# EAGLE schematic Data_memory (EAGLE 9.4.2)
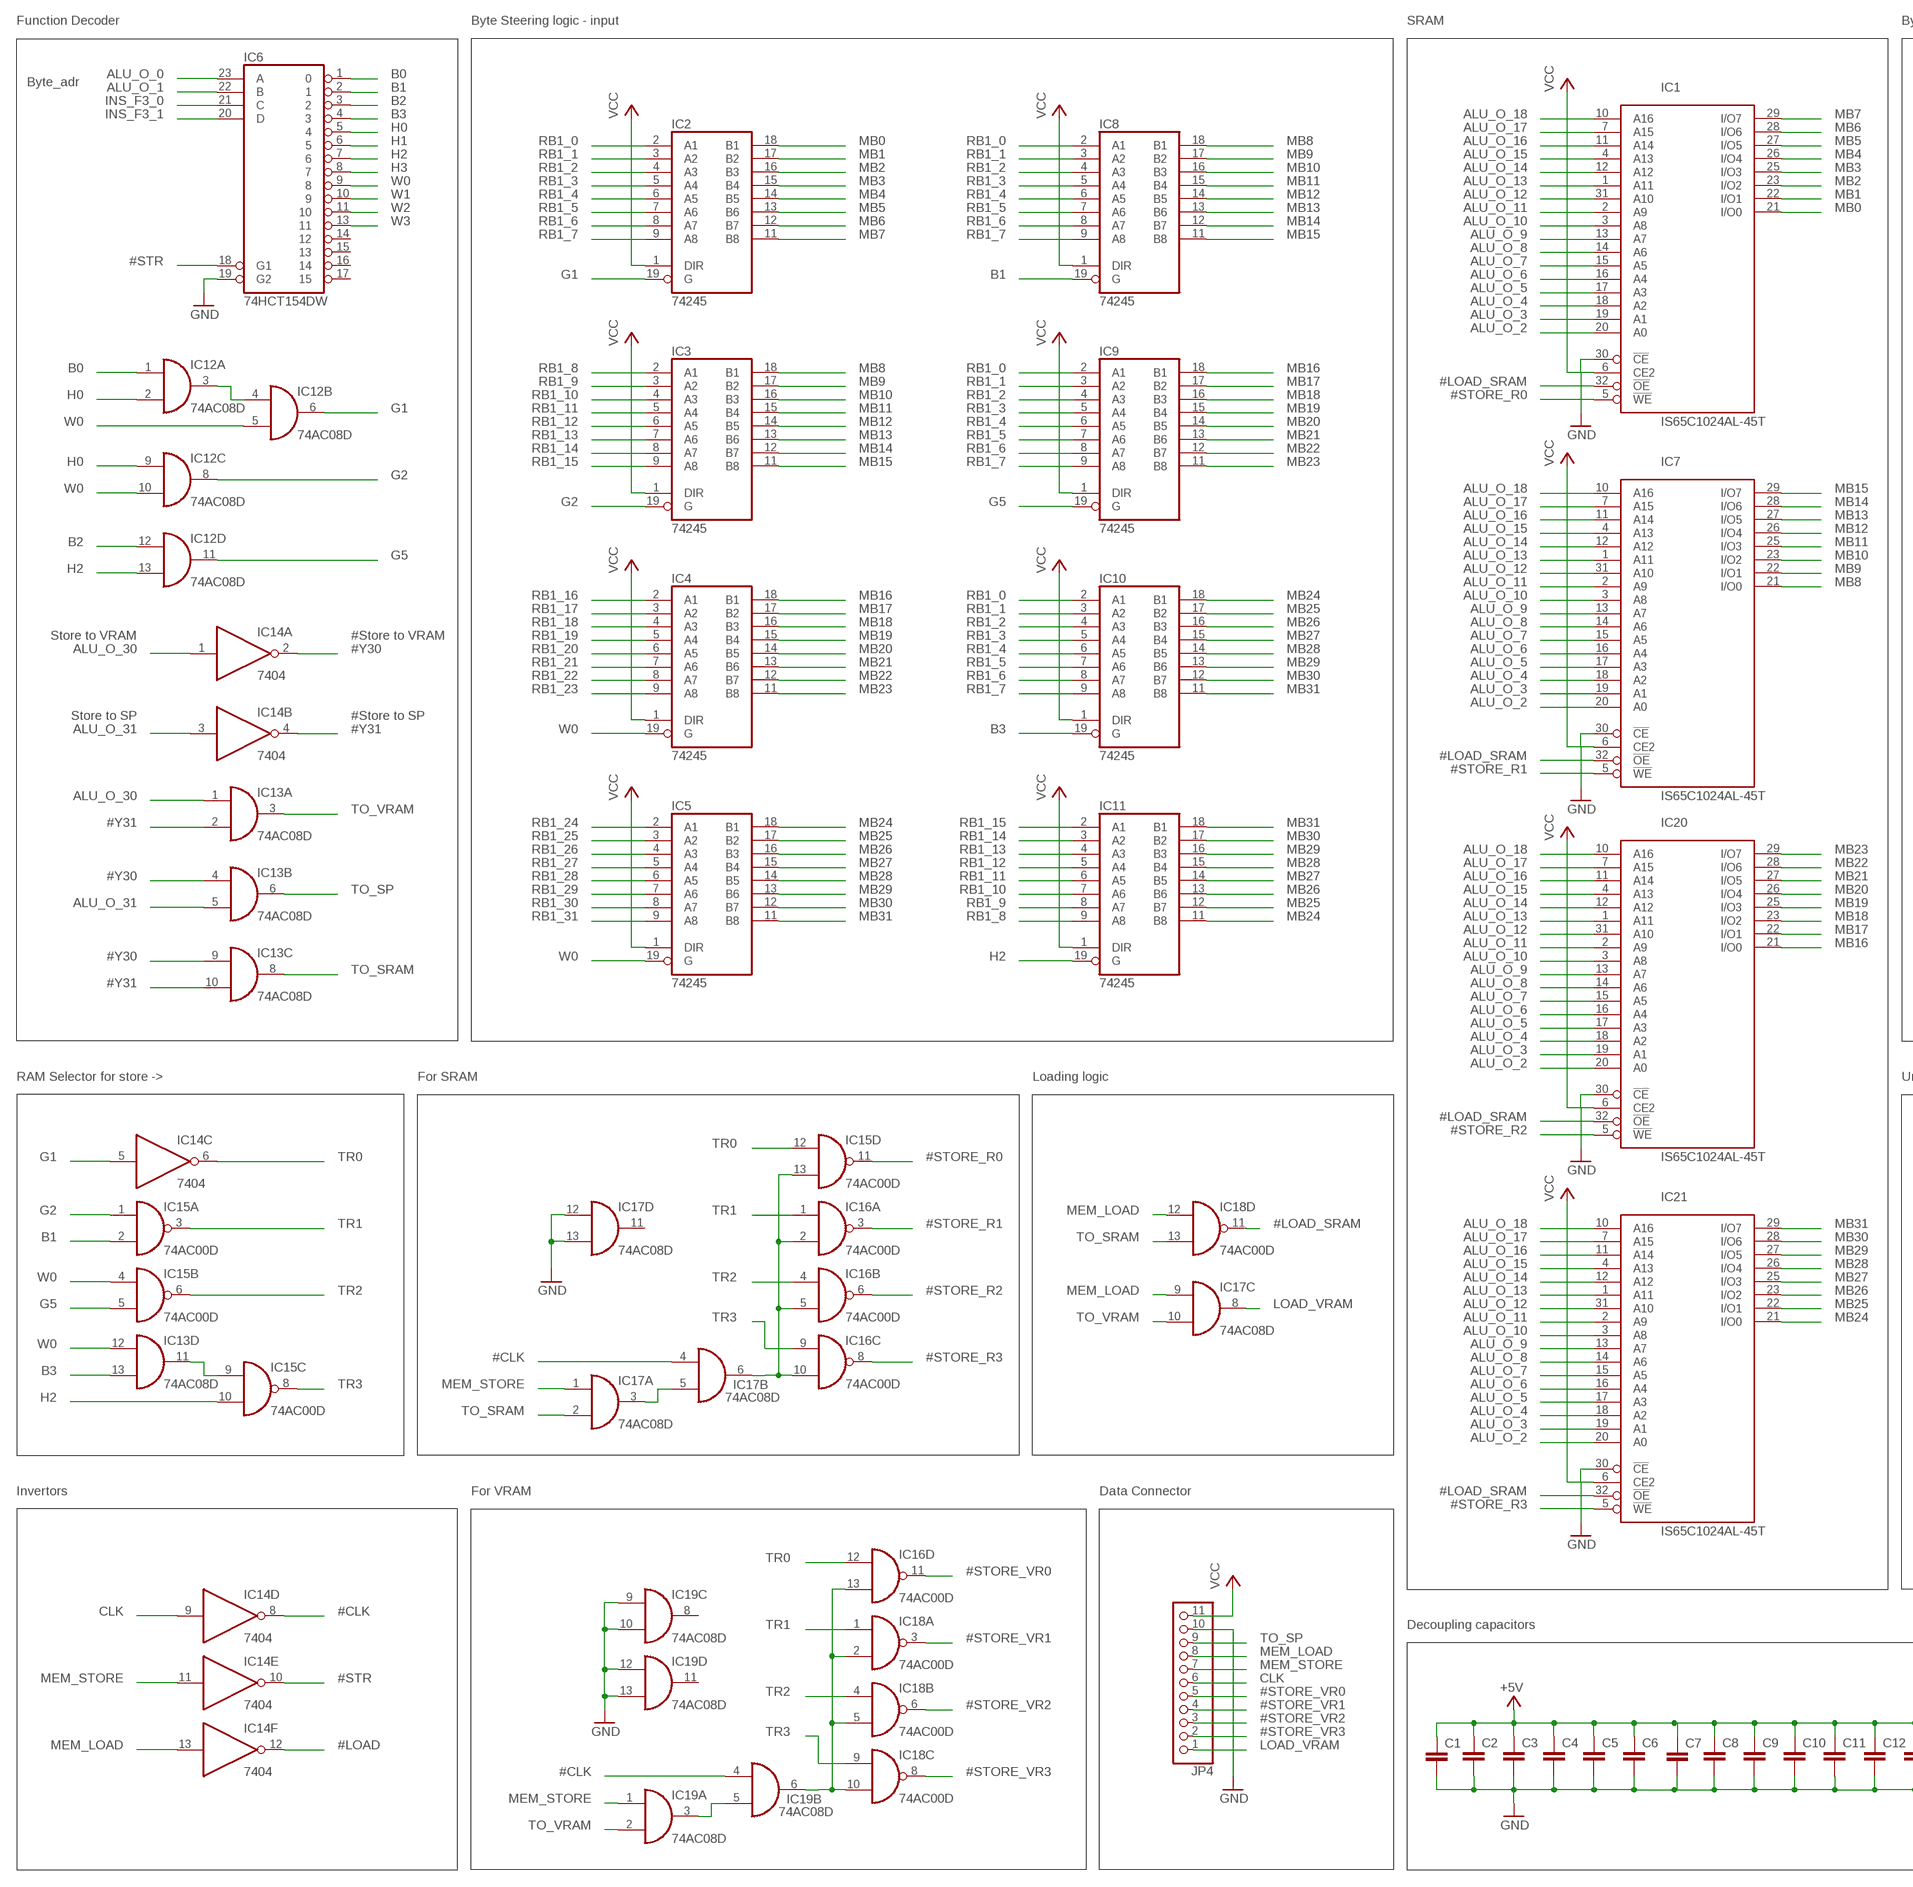
[diagram p0: schematic, sheet 1, part 1 of 2]
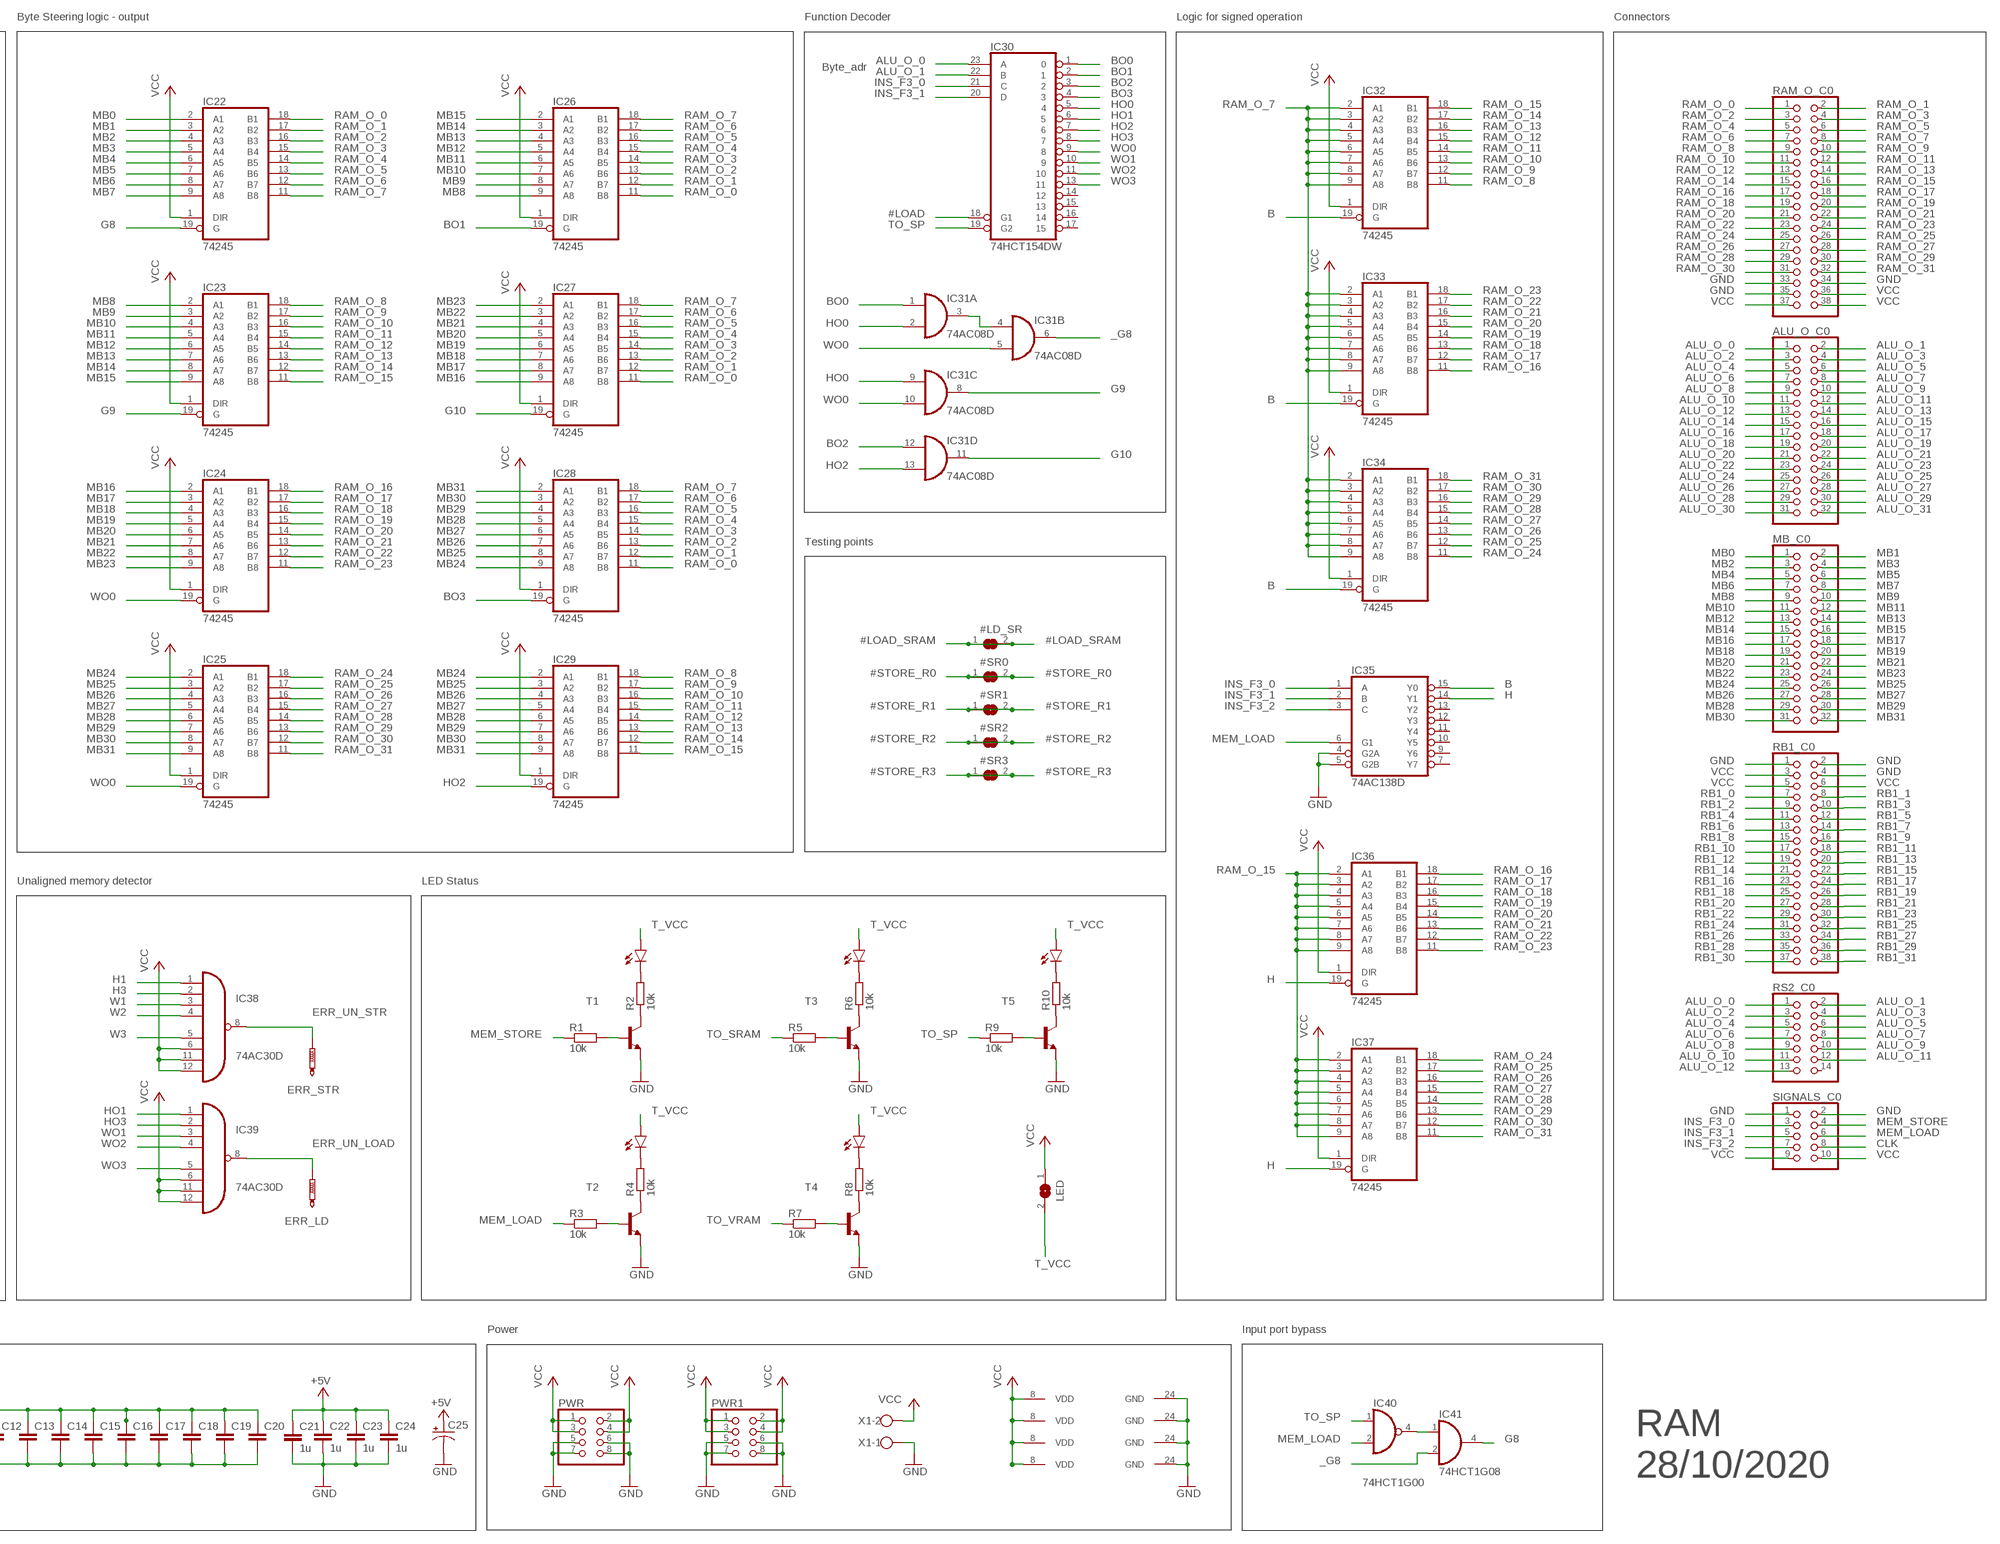
[diagram p1: schematic, sheet 1, part 2 of 2]

## Parts
#LD_SR  SJ  [SJ]
#SR0  SJ  [SJ]
#SR1  SJ  [SJ]
#SR2  SJ  [SJ]
#SR3  SJ  [SJ]
ALU_O_C0  PINHD-2X16  [2X16]
C1  C-EUC0805  [C0805]
C2  C-EUC0805  [C0805]
C3  C-EUC0805  [C0805]
C4  C-EUC0805  [C0805]
C5  C-EUC0805  [C0805]
C6  C-EUC0805  [C0805]
C7  C-EUC0805  [C0805]
C8  C-EUC0805  [C0805]
C9  C-EUC0805  [C0805]
C10  C-EUC0805  [C0805]
C11  C-EUC0805  [C0805]
C12  C-EUC0805  [C0805]
C13  C-EUC0805  [C0805]
C14  C-EUC0805  [C0805]
C15  C-EUC0805  [C0805]
C16  C-EUC0805  [C0805]
C17  C-EUC0805  [C0805]
C18  C-EUC0805  [C0805]
C19  C-EUC0805  [C0805]
C20  C-EUC0805  [C0805]
C21  1u  C-EUC0805  [C0805]
C22  1u  C-EUC0805  [C0805]
C23  1u  C-EUC0805  [C0805]
C24  1u  C-EUC0805  [C0805]
C25  CAPACITOR-P153CLV-1010  [153CLV-1010]
ERR_LD  PTR1B2,54  [B2,54]
ERR_STR  PTR1B2,54  [B2,54]
IC1  IS65C1024AL-45T  [TSOP-I-32-8X20MM]
IC2  74245  [TSSOP20]
IC3  74245  [TSSOP20]
IC4  74245  [TSSOP20]
IC5  74245  [TSSOP20]
IC6  74HCT154DW  [SO24W]
IC7  IS65C1024AL-45T  [TSOP-I-32-8X20MM]
IC8  74245  [TSSOP20]
IC9  74245  [TSSOP20]
IC10  74245  [TSSOP20]
IC11  74245  [TSSOP20]
IC12  74AC08D  [SO14]
IC13  74AC08D  [SO14]
IC14  7404  [TSSOP14]
IC15  74AC00D  [SO14]
IC16  74AC00D  [SO14]
IC17  74AC08D  [SO14]
IC18  74AC00D  [SO14]
IC19  74AC08D  [SO14]
IC20  IS65C1024AL-45T  [TSOP-I-32-8X20MM]
IC21  IS65C1024AL-45T  [TSOP-I-32-8X20MM]
IC22  74245  [TSSOP20]
IC23  74245  [TSSOP20]
IC24  74245  [TSSOP20]
IC25  74245  [TSSOP20]
IC26  74245  [TSSOP20]
IC27  74245  [TSSOP20]
IC28  74245  [TSSOP20]
IC29  74245  [TSSOP20]
IC30  74HCT154DW  [SO24W]
IC31  74AC08D  [SO14]
IC32  74245  [TSSOP20]
IC33  74245  [TSSOP20]
IC34  74245  [TSSOP20]
IC35  74AC138D  [SO16]
IC36  74245  [TSSOP20]
IC37  74245  [TSSOP20]
IC38  74AC30D  [SO14]
IC39  74AC30D  [SO14]
IC40  74HCT1G00  74AHC1G00DBV  [SOT23-5]
IC41  74HCT1G08  74AHC1G08DBV  [SOT23-5]
JP4  PINHD-1X11  [1X11]
LED  SJ  [SJ]
LED1  LEDSML0805  [SML0805]
LED2  LEDSML0805  [SML0805]
LED3  LEDSML0805  [SML0805]
LED4  LEDSML0805  [SML0805]
LED8  LEDSML0805  [SML0805]
MB_C0  PINHD-2X16  [2X16]
PWR  PINHD-2X4  [2X04]
PWR1  PINHD-2X4  [2X04]
R1  10k  R-EU_M0805  [M0805]
R2  10k  R-EU_M0805  [M0805]
R3  10k  R-EU_M0805  [M0805]
R4  10k  R-EU_M0805  [M0805]
R5  10k  R-EU_M0805  [M0805]
R6  10k  R-EU_M0805  [M0805]
R7  10k  R-EU_M0805  [M0805]
R8  10k  R-EU_M0805  [M0805]
R9  10k  R-EU_M0805  [M0805]
R10  10k  R-EU_M0805  [M0805]
RAM_O_C0  PINHD-2X19  [2X19]
RB1_C0  PINHD-2X19  [2X19]
RS2_C0  PINHD-2X7  [2X07]
SIGNALS_C0  PINHD-2X5  [2X05]
T1  MMBT4401LT1-NPN-SOT23-BEC  [SOT23-BEC]
T2  MMBT4401LT1-NPN-SOT23-BEC  [SOT23-BEC]
T3  MMBT4401LT1-NPN-SOT23-BEC  [SOT23-BEC]
T4  MMBT4401LT1-NPN-SOT23-BEC  [SOT23-BEC]
T5  MMBT4401LT1-NPN-SOT23-BEC  [SOT23-BEC]
X1  W237-102  [W237-102]

## Nets
#CLK: IC14.8(D:O) IC17.4(B:I0) IC19.4(B:I0)
#LOAD: IC14.12(F:O) IC30.18(G1)
#LOAD_SRAM: #LD_SR.1 #LD_SR.2 IC1.32(!OE) IC7.32(!OE) IC18.11(D:O) IC20.32(!OE) IC21.32(!OE)
#STORE_R0: #SR0.1 #SR0.2 IC1.5(!WE) IC15.11(D:O)
#STORE_R1: #SR1.1 #SR1.2 IC7.5(!WE) IC16.3(A:O)
#STORE_R2: #SR2.1 #SR2.2 IC16.6(B:O) IC20.5(!WE)
#STORE_R3: #SR3.1 #SR3.2 IC16.8(C:O) IC21.5(!WE)
#STORE_VR0: IC16.11(D:O) JP4.5
#STORE_VR1: IC18.3(A:O) JP4.4
#STORE_VR2: IC18.6(B:O) JP4.3
#STORE_VR3: IC18.8(C:O) JP4.2
#STR: IC6.18(G1) IC14.10(E:O)
#Y30: IC13.4(B:I0) IC13.9(C:I0) IC14.2(A:O)
#Y31: IC13.2(A:I1) IC13.10(C:I1) IC14.4(B:O)
_G8: IC31.6(B:O) IC41.2(I1)
ALU_O_0: ALU_O_C0.1 IC6.23(A) IC30.23(A) RS2_C0.1
ALU_O_1: ALU_O_C0.2 IC6.22(B) IC30.22(B) RS2_C0.2
ALU_O_2: ALU_O_C0.3 IC1.20(A0) IC7.20(A0) IC20.20(A0) IC21.20(A0) RS2_C0.3
ALU_O_3: ALU_O_C0.4 IC1.19(A1) IC7.19(A1) IC20.19(A1) IC21.19(A1) RS2_C0.4
ALU_O_4: ALU_O_C0.5 IC1.18(A2) IC7.18(A2) IC20.18(A2) IC21.18(A2) RS2_C0.5
ALU_O_5: ALU_O_C0.6 IC1.17(A3) IC7.17(A3) IC20.17(A3) IC21.17(A3) RS2_C0.6
ALU_O_6: ALU_O_C0.7 IC1.16(A4) IC7.16(A4) IC20.16(A4) IC21.16(A4) RS2_C0.7
ALU_O_7: ALU_O_C0.8 IC1.15(A5) IC7.15(A5) IC20.15(A5) IC21.15(A5) RS2_C0.8
ALU_O_8: ALU_O_C0.9 IC1.14(A6) IC7.14(A6) IC20.14(A6) IC21.14(A6) RS2_C0.9
ALU_O_9: ALU_O_C0.10 IC1.13(A7) IC7.13(A7) IC20.13(A7) IC21.13(A7) RS2_C0.10
ALU_O_10: ALU_O_C0.11 IC1.3(A8) IC7.3(A8) IC20.3(A8) IC21.3(A8) RS2_C0.11
ALU_O_11: ALU_O_C0.12 IC1.2(A9) IC7.2(A9) IC20.2(A9) IC21.2(A9) RS2_C0.12
ALU_O_12: ALU_O_C0.13 IC1.31(A10) IC7.31(A10) IC20.31(A10) IC21.31(A10) RS2_C0.13
ALU_O_13: ALU_O_C0.14 IC1.1(A11) IC7.1(A11) IC20.1(A11) IC21.1(A11)
ALU_O_14: ALU_O_C0.15 IC1.12(A12) IC7.12(A12) IC20.12(A12) IC21.12(A12)
ALU_O_15: ALU_O_C0.16 IC1.4(A13) IC7.4(A13) IC20.4(A13) IC21.4(A13)
ALU_O_16: ALU_O_C0.17 IC1.11(A14) IC7.11(A14) IC20.11(A14) IC21.11(A14)
ALU_O_17: ALU_O_C0.18 IC1.7(A15) IC7.7(A15) IC20.7(A15) IC21.7(A15)
ALU_O_18: ALU_O_C0.19 IC1.10(A16) IC7.10(A16) IC20.10(A16) IC21.10(A16)
ALU_O_19: ALU_O_C0.20
ALU_O_20: ALU_O_C0.21
ALU_O_21: ALU_O_C0.22
ALU_O_22: ALU_O_C0.23
ALU_O_23: ALU_O_C0.24
ALU_O_24: ALU_O_C0.25
ALU_O_25: ALU_O_C0.26
ALU_O_26: ALU_O_C0.27
ALU_O_27: ALU_O_C0.28
ALU_O_28: ALU_O_C0.29
ALU_O_29: ALU_O_C0.30
ALU_O_30: ALU_O_C0.31 IC13.1(A:I0) IC14.1(A:I)
ALU_O_31: ALU_O_C0.32 IC13.5(B:I1) IC14.3(B:I)
B: IC32.19(G) IC33.19(G) IC34.19(G) IC35.15(Y0)
B0: IC6.1 IC12.1(A:I0)
B1: IC6.2 IC8.19(G) IC15.2(A:I1)
B2: IC6.3 IC12.12(D:I0)
B3: IC6.4 IC10.19(G) IC13.13(D:I1)
BO0: IC30.1 IC31.1(A:I0)
BO1: IC26.19(G) IC30.2
BO2: IC30.3 IC31.12(D:I0)
BO3: IC28.19(G) IC30.4
CLK: IC14.9(D:I) JP4.6 SIGNALS_C0.8
ERR_UN_LOAD: ERR_LD.TP IC39.8(O)
ERR_UN_STR: ERR_STR.TP IC38.8(O)
G1: IC2.19(G) IC12.6(B:O) IC14.5(C:I)
G2: IC3.19(G) IC12.8(C:O) IC15.1(A:I0)
G5: IC9.19(G) IC12.11(D:O) IC15.5(B:I1)
G8: IC22.19(G) IC41.4(O)
G9: IC23.19(G) IC31.8(C:O)
G10: IC27.19(G) IC31.11(D:O)
GND: C1.2 C2.2 C3.2 C4.2 C5.2 C6.2 C7.2 C8.2 C9.2 C10.2 C11.2 C12.2 C13.2 C14.2 C15.2 C16.2 C17.2 C18.2 C19.2 C20.2 C21.2 C22.2 C23.2 C24.2 C25.- IC1.24(GND) IC1.30(!CE) IC6.19(G2) IC7.24(GND) IC7.30(!CE) IC17.12(D:I0) IC17.13(D:I1) IC19.9(C:I0) IC19.10(C:I1) IC19.12(D:I0) IC19.13(D:I1) IC20.24(GND) IC20.30(!CE) IC21.24(GND) IC21.30(!CE) IC35.4(G2A) IC35.5(G2B) JP4.10 PWR1.5 PWR1.6 PWR1.7 PWR1.8 PWR.5 PWR.6 PWR.7 PWR.8 RAM_O_C0.33 RAM_O_C0.34 RAM_O_C0.35 RB1_C0.1 RB1_C0.2 RB1_C0.4 SIGNALS_C0.1 SIGNALS_C0.2 T1.E T2.E T3.E T4.E T5.E X1.1
H: IC35.14(Y1) IC36.19(G) IC37.19(G)
H0: IC6.5 IC12.2(A:I1) IC12.9(C:I0)
H1: IC6.6 IC38.1(I0)
H2: IC6.7 IC11.19(G) IC12.13(D:I1) IC15.10(C:I1)
H3: IC6.8 IC38.2(I1)
HO0: IC30.5 IC31.2(A:I1) IC31.9(C:I0)
HO1: IC30.6 IC39.1(I0)
HO2: IC29.19(G) IC30.7 IC31.13(D:I1)
HO3: IC30.8 IC39.2(I1)
INS_F3_0: IC6.21(C) IC30.21(C) IC35.1(A) SIGNALS_C0.3
INS_F3_1: IC6.20(D) IC30.20(D) IC35.2(B) SIGNALS_C0.5
INS_F3_2: IC35.3(C) SIGNALS_C0.7
LOAD_VRAM: IC17.8(C:O) JP4.1
MB0: IC1.21(I/O0) IC2.18(B1) IC22.2(A1) MB_C0.1
MB1: IC1.22(I/O1) IC2.17(B2) IC22.3(A2) MB_C0.2
MB2: IC1.23(I/O2) IC2.16(B3) IC22.4(A3) MB_C0.3
MB3: IC1.25(I/O3) IC2.15(B4) IC22.5(A4) MB_C0.4
MB4: IC1.26(I/O4) IC2.14(B5) IC22.6(A5) MB_C0.5
MB5: IC1.27(I/O5) IC2.13(B6) IC22.7(A6) MB_C0.6
MB6: IC1.28(I/O6) IC2.12(B7) IC22.8(A7) MB_C0.7
MB7: IC1.29(I/O7) IC2.11(B8) IC22.9(A8) MB_C0.8
MB8: IC3.18(B1) IC7.21(I/O0) IC8.18(B1) IC23.2(A1) IC26.9(A8) MB_C0.9
MB9: IC3.17(B2) IC7.22(I/O1) IC8.17(B2) IC23.3(A2) IC26.8(A7) MB_C0.10
MB10: IC3.16(B3) IC7.23(I/O2) IC8.16(B3) IC23.4(A3) IC26.7(A6) MB_C0.11
MB11: IC3.15(B4) IC7.25(I/O3) IC8.15(B4) IC23.5(A4) IC26.6(A5) MB_C0.12
MB12: IC3.14(B5) IC7.26(I/O4) IC8.14(B5) IC23.6(A5) IC26.5(A4) MB_C0.13
MB13: IC3.13(B6) IC7.27(I/O5) IC8.13(B6) IC23.7(A6) IC26.4(A3) MB_C0.14
MB14: IC3.12(B7) IC7.28(I/O6) IC8.12(B7) IC23.8(A7) IC26.3(A2) MB_C0.15
MB15: IC3.11(B8) IC7.29(I/O7) IC8.11(B8) IC23.9(A8) IC26.2(A1) MB_C0.16
MB16: IC4.18(B1) IC9.18(B1) IC20.21(I/O0) IC24.2(A1) IC27.9(A8) MB_C0.17
MB17: IC4.17(B2) IC9.17(B2) IC20.22(I/O1) IC24.3(A2) IC27.8(A7) MB_C0.18
MB18: IC4.16(B3) IC9.16(B3) IC20.23(I/O2) IC24.4(A3) IC27.7(A6) MB_C0.19
MB19: IC4.15(B4) IC9.15(B4) IC20.25(I/O3) IC24.5(A4) IC27.6(A5) MB_C0.20
MB20: IC4.14(B5) IC9.14(B5) IC20.26(I/O4) IC24.6(A5) IC27.5(A4) MB_C0.21
MB21: IC4.13(B6) IC9.13(B6) IC20.27(I/O5) IC24.7(A6) IC27.4(A3) MB_C0.22
MB22: IC4.12(B7) IC9.12(B7) IC20.28(I/O6) IC24.8(A7) IC27.3(A2) MB_C0.23
MB23: IC4.11(B8) IC9.11(B8) IC20.29(I/O7) IC24.9(A8) IC27.2(A1) MB_C0.24
MB24: IC5.18(B1) IC10.18(B1) IC11.11(B8) IC21.21(I/O0) IC25.2(A1) IC28.9(A8) IC29.2(A1) MB_C0.25
MB25: IC5.17(B2) IC10.17(B2) IC11.12(B7) IC21.22(I/O1) IC25.3(A2) IC28.8(A7) IC29.3(A2) MB_C0.26
MB26: IC5.16(B3) IC10.16(B3) IC11.13(B6) IC21.23(I/O2) IC25.4(A3) IC28.7(A6) IC29.4(A3) MB_C0.27
MB27: IC5.15(B4) IC10.15(B4) IC11.14(B5) IC21.25(I/O3) IC25.5(A4) IC28.6(A5) IC29.5(A4) MB_C0.28
MB28: IC5.14(B5) IC10.14(B5) IC11.15(B4) IC21.26(I/O4) IC25.6(A5) IC28.5(A4) IC29.6(A5) MB_C0.29
MB29: IC5.13(B6) IC10.13(B6) IC11.16(B3) IC21.27(I/O5) IC25.7(A6) IC28.4(A3) IC29.7(A6) MB_C0.30
MB30: IC5.12(B7) IC10.12(B7) IC11.17(B2) IC21.28(I/O6) IC25.8(A7) IC28.3(A2) IC29.8(A7) MB_C0.31
MB31: IC5.11(B8) IC10.11(B8) IC11.18(B1) IC21.29(I/O7) IC25.9(A8) IC28.2(A1) IC29.9(A8) MB_C0.32
MEM_LOAD: IC14.13(F:I) IC17.9(C:I0) IC18.12(D:I0) IC35.6(G1) IC40.2(I1) JP4.8 R3.1 SIGNALS_C0.6
MEM_STORE: IC14.11(E:I) IC17.1(A:I0) IC19.1(A:I0) JP4.7 R1.1 SIGNALS_C0.4
N$1: IC12.3(A:O) IC12.4(B:I0)
N$2: IC13.11(D:O) IC15.9(C:I0)
N$3: IC17.3(A:O) IC17.5(B:I1)
N$4: IC16.13(D:I1) IC18.2(A:I1) IC18.5(B:I1) IC18.10(C:I1) IC19.6(B:O)
N$5: IC19.3(A:O) IC19.5(B:I1)
N$6: IC31.3(A:O) IC31.4(B:I0)
N$7: IC15.13(D:I1) IC16.2(A:I1) IC16.5(B:I1) IC16.10(C:I1) IC17.6(B:O)
N$8: R1.2 T1.B
N$9: R3.2 T2.B
N$10: LED1.C R2.2
N$11: R2.1 T1.C
N$12: LED8.C R4.2
N$13: R4.1 T2.C
N$14: R5.2 T3.B
N$15: LED2.C R6.2
N$16: R6.1 T3.C
N$17: R7.2 T4.B
N$18: LED3.C R8.2
N$19: R8.1 T4.C
N$20: R9.2 T5.B
N$21: LED4.C R10.2
N$22: R10.1 T5.C
N$23: IC40.4(O) IC41.1(I0)
RAM_O_0: IC22.18(B1) IC26.11(B8) IC27.11(B8) IC28.11(B8) RAM_O_C0.1
RAM_O_1: IC22.17(B2) IC26.12(B7) IC27.12(B7) IC28.12(B7) RAM_O_C0.2
RAM_O_2: IC22.16(B3) IC26.13(B6) IC27.13(B6) IC28.13(B6) RAM_O_C0.3
RAM_O_3: IC22.15(B4) IC26.14(B5) IC27.14(B5) IC28.14(B5) RAM_O_C0.4
RAM_O_4: IC22.14(B5) IC26.15(B4) IC27.15(B4) IC28.15(B4) RAM_O_C0.5
RAM_O_5: IC22.13(B6) IC26.16(B3) IC27.16(B3) IC28.16(B3) RAM_O_C0.6
RAM_O_6: IC22.12(B7) IC26.17(B2) IC27.17(B2) IC28.17(B2) RAM_O_C0.7
RAM_O_7: IC22.11(B8) IC26.18(B1) IC27.18(B1) IC28.18(B1) IC32.2(A1) IC32.3(A2) IC32.4(A3) IC32.5(A4) IC32.6(A5) IC32.7(A6) IC32.8(A7) IC32.9(A8) IC33.2(A1) IC33.3(A2) IC33.4(A3) IC33.5(A4) IC33.6(A5) IC33.7(A6) IC33.8(A7) IC33.9(A8) IC34.2(A1) IC34.3(A2) IC34.4(A3) IC34.5(A4) IC34.6(A5) IC34.7(A6) IC34.8(A7) IC34.9(A8) RAM_O_C0.8
RAM_O_8: IC23.18(B1) IC29.18(B1) IC32.11(B8) RAM_O_C0.9
RAM_O_9: IC23.17(B2) IC29.17(B2) IC32.12(B7) RAM_O_C0.10
RAM_O_10: IC23.16(B3) IC29.16(B3) IC32.13(B6) RAM_O_C0.11
RAM_O_11: IC23.15(B4) IC29.15(B4) IC32.14(B5) RAM_O_C0.12
RAM_O_12: IC23.14(B5) IC29.14(B5) IC32.15(B4) RAM_O_C0.13
RAM_O_13: IC23.13(B6) IC29.13(B6) IC32.16(B3) RAM_O_C0.14
RAM_O_14: IC23.12(B7) IC29.12(B7) IC32.17(B2) RAM_O_C0.15
RAM_O_15: IC23.11(B8) IC29.11(B8) IC32.18(B1) IC36.2(A1) IC36.3(A2) IC36.4(A3) IC36.5(A4) IC36.6(A5) IC36.7(A6) IC36.8(A7) IC36.9(A8) IC37.2(A1) IC37.3(A2) IC37.4(A3) IC37.5(A4) IC37.6(A5) IC37.7(A6) IC37.8(A7) IC37.9(A8) RAM_O_C0.16
RAM_O_16: IC24.18(B1) IC33.11(B8) IC36.18(B1) RAM_O_C0.17
RAM_O_17: IC24.17(B2) IC33.12(B7) IC36.17(B2) RAM_O_C0.18
RAM_O_18: IC24.16(B3) IC33.13(B6) IC36.16(B3) RAM_O_C0.19
RAM_O_19: IC24.15(B4) IC33.14(B5) IC36.15(B4) RAM_O_C0.20
RAM_O_20: IC24.14(B5) IC33.15(B4) IC36.14(B5) RAM_O_C0.21
RAM_O_21: IC24.13(B6) IC33.16(B3) IC36.13(B6) RAM_O_C0.22
RAM_O_22: IC24.12(B7) IC33.17(B2) IC36.12(B7) RAM_O_C0.23
RAM_O_23: IC24.11(B8) IC33.18(B1) IC36.11(B8) RAM_O_C0.24
RAM_O_24: IC25.18(B1) IC34.11(B8) IC37.18(B1) RAM_O_C0.25
RAM_O_25: IC25.17(B2) IC34.12(B7) IC37.17(B2) RAM_O_C0.26
RAM_O_26: IC25.16(B3) IC34.13(B6) IC37.16(B3) RAM_O_C0.27
RAM_O_27: IC25.15(B4) IC34.14(B5) IC37.15(B4) RAM_O_C0.28
RAM_O_28: IC25.14(B5) IC34.15(B4) IC37.14(B5) RAM_O_C0.29
RAM_O_29: IC25.13(B6) IC34.16(B3) IC37.13(B6) RAM_O_C0.30
RAM_O_30: IC25.12(B7) IC34.17(B2) IC37.12(B7) RAM_O_C0.31
RAM_O_31: IC25.11(B8) IC34.18(B1) IC37.11(B8) RAM_O_C0.32
RB1_0: IC2.2(A1) IC8.2(A1) IC9.2(A1) IC10.2(A1) RB1_C0.7
RB1_1: IC2.3(A2) IC8.3(A2) IC9.3(A2) IC10.3(A2) RB1_C0.8
RB1_2: IC2.4(A3) IC8.4(A3) IC9.4(A3) IC10.4(A3) RB1_C0.9
RB1_3: IC2.5(A4) IC8.5(A4) IC9.5(A4) IC10.5(A4) RB1_C0.10
RB1_4: IC2.6(A5) IC8.6(A5) IC9.6(A5) IC10.6(A5) RB1_C0.11
RB1_5: IC2.7(A6) IC8.7(A6) IC9.7(A6) IC10.7(A6) RB1_C0.12
RB1_6: IC2.8(A7) IC8.8(A7) IC9.8(A7) IC10.8(A7) RB1_C0.13
RB1_7: IC2.9(A8) IC8.9(A8) IC9.9(A8) IC10.9(A8) RB1_C0.14
RB1_8: IC3.2(A1) IC11.9(A8) RB1_C0.15
RB1_9: IC3.3(A2) IC11.8(A7) RB1_C0.16
RB1_10: IC3.4(A3) IC11.7(A6) RB1_C0.17
RB1_11: IC3.5(A4) IC11.6(A5) RB1_C0.18
RB1_12: IC3.6(A5) IC11.5(A4) RB1_C0.19
RB1_13: IC3.7(A6) IC11.4(A3) RB1_C0.20
RB1_14: IC3.8(A7) IC11.3(A2) RB1_C0.21
RB1_15: IC3.9(A8) IC11.2(A1) RB1_C0.22
RB1_16: IC4.2(A1) RB1_C0.23
RB1_17: IC4.3(A2) RB1_C0.24
RB1_18: IC4.4(A3) RB1_C0.25
RB1_19: IC4.5(A4) RB1_C0.26
RB1_20: IC4.6(A5) RB1_C0.27
RB1_21: IC4.7(A6) RB1_C0.28
RB1_22: IC4.8(A7) RB1_C0.29
RB1_23: IC4.9(A8) RB1_C0.30
RB1_24: IC5.2(A1) RB1_C0.31
RB1_25: IC5.3(A2) RB1_C0.32
RB1_26: IC5.4(A3) RB1_C0.33
RB1_27: IC5.5(A4) RB1_C0.34
RB1_28: IC5.6(A5) RB1_C0.35
RB1_29: IC5.7(A6) RB1_C0.36
RB1_30: IC5.8(A7) RB1_C0.37
RB1_31: IC5.9(A8) RB1_C0.38
T_VCC: LED1.A LED2.A LED3.A LED4.A LED8.A LED.2
TO_SP: IC13.6(B:O) IC30.19(G2) IC40.1(I0) JP4.9 R9.1
TO_SRAM: IC13.8(C:O) IC17.2(A:I1) IC18.13(D:I1) R5.1
TO_VRAM: IC13.3(A:O) IC17.10(C:I1) IC19.2(A:I1) R7.1
TR0: IC14.6(C:O) IC15.12(D:I0) IC16.12(D:I0)
TR1: IC15.3(A:O) IC16.1(A:I0) IC18.1(A:I0)
TR2: IC15.6(B:O) IC16.4(B:I0) IC18.4(B:I0)
TR3: IC15.8(C:O) IC16.9(C:I0) IC18.9(C:I0)
VCC: C1.1 C2.1 C3.1 C4.1 C5.1 C6.1 C7.1 C8.1 C9.1 C10.1 C11.1 C12.1 C13.1 C14.1 C15.1 C16.1 C17.1 C18.1 C19.1 C20.1 C21.1 C22.1 C23.1 C24.1 C25.+ IC1.6(CE2) IC1.8(VDD) IC2.1(DIR) IC3.1(DIR) IC4.1(DIR) IC5.1(DIR) IC7.6(CE2) IC7.8(VDD) IC8.1(DIR) IC9.1(DIR) IC10.1(DIR) IC11.1(DIR) IC20.6(CE2) IC20.8(VDD) IC21.6(CE2) IC21.8(VDD) IC22.1(DIR) IC23.1(DIR) IC24.1(DIR) IC25.1(DIR) IC26.1(DIR) IC27.1(DIR) IC28.1(DIR) IC29.1(DIR) IC32.1(DIR) IC33.1(DIR) IC34.1(DIR) IC36.1(DIR) IC37.1(DIR) IC38.6(I5) IC38.11(I6) IC38.12(I7) IC39.6(I5) IC39.11(I6) IC39.12(I7) JP4.11 LED.1 PWR1.1 PWR1.2 PWR1.3 PWR1.4 PWR.1 PWR.2 PWR.3 PWR.4 RAM_O_C0.36 RAM_O_C0.37 RAM_O_C0.38 RB1_C0.3 RB1_C0.5 RB1_C0.6 SIGNALS_C0.9 SIGNALS_C0.10 X1.2 ; supply symbol labelled +5V
W0: IC4.19(G) IC5.19(G) IC6.9 IC12.5(B:I1) IC12.10(C:I1) IC13.12(D:I0) IC15.4(B:I0)
W1: IC6.10 IC38.3(I2)
W2: IC6.11 IC38.4(I3)
W3: IC6.13 IC38.5(I4)
WO0: IC24.19(G) IC25.19(G) IC30.9 IC31.5(B:I1) IC31.10(C:I1)
WO1: IC30.10 IC39.3(I2)
WO2: IC30.11 IC39.4(I3)
WO3: IC30.13 IC39.5(I4)
Unconnected: IC6.14 IC6.15 IC6.16 IC6.17 IC17.11(D:O) IC19.8(C:O) IC19.11(D:O) IC30.14 IC30.15 IC30.16 IC30.17 IC35.7(Y7) IC35.9(Y6) IC35.10(Y5) IC35.11(Y4) IC35.12(Y3) IC35.13(Y2) RS2_C0.14

## Notes on the sheet
- Function Decoder | Byte Steering logic - input | SRAM | Byte Steering logic - output | Function Decoder | Logic for signed operation | Connectors
- Byte_adr | Byte_adr
- Store to VRAM | #Store to VRAM
- Testing points
- Store to SP | #Store to SP
- RAM Selector for store -> | For SRAM | Loading logic | Unaligned memory detector | LED Status
- Invertors | For VRAM | Data Connector
- Decoupling capacitors | Power | Input port bypass
- RAM
  28/10/2020

## Power pins joined to a net without a drawn wire
GND: IC2.10(GND) IC3.10(GND) IC4.10(GND) IC5.10(GND) IC6.12(GND) IC8.10(GND) IC9.10(GND) IC10.10(GND) IC11.10(GND) IC12.7(P:GND) IC13.7(P:GND) IC14.7(P:GND) IC15.7(P:GND) IC16.7(P:GND) IC17.7(P:GND) IC18.7(P:GND) IC19.7(P:GND) IC22.10(GND) IC23.10(GND) IC24.10(GND) IC25.10(GND) IC26.10(GND) IC27.10(GND) IC28.10(GND) IC29.10(GND) IC30.12(GND) IC31.7(P:GND) IC32.10(GND) IC33.10(GND) IC34.10(GND) IC35.8(GND) IC36.10(GND) IC37.10(GND) IC38.7(GND) IC39.7(GND) IC40.3(GND) IC41.3(GND)
VCC: IC2.20(VCC) IC3.20(VCC) IC4.20(VCC) IC5.20(VCC) IC6.24(VCC) IC8.20(VCC) IC9.20(VCC) IC10.20(VCC) IC11.20(VCC) IC12.14(P:VCC) IC13.14(P:VCC) IC14.14(P:VCC) IC15.14(P:VCC) IC16.14(P:VCC) IC17.14(P:VCC) IC18.14(P:VCC) IC19.14(P:VCC) IC22.20(VCC) IC23.20(VCC) IC24.20(VCC) IC25.20(VCC) IC26.20(VCC) IC27.20(VCC) IC28.20(VCC) IC29.20(VCC) IC30.24(VCC) IC31.14(P:VCC) IC32.20(VCC) IC33.20(VCC) IC34.20(VCC) IC35.16(VCC) IC36.20(VCC) IC37.20(VCC) IC38.14(VCC) IC39.14(VCC) IC40.5(VCC) IC41.5(VCC)

## Library data of the parts
#LD_SR #SR0 #SR1-#SR3 LED = jumper:SJ: SMD solder JUMPER
ALU_O_C0 = pinhead_bottom:PINHD-2X16: PIN HEADER
C1-C24 = rcl:C-EU: CAPACITOR, European symbol; SPICEPREFIX: C
C25 = BeagleBone_Blue_R3:CAPACITOR-P: POLARIZED CAPACITOR, American symbol
ERR_LD ERR_STR = testpad:PTR1: TEST PIN
IC1 IC7 IC20 IC21 = memory-issi-asynsram:IS65C1024AL-*: 128k x 8 high- speed CMOS static RAM 45ns access time 5V power supply
IC2-IC5 IC8-IC11 IC22-IC29 IC32-IC34 IC36 IC37 = AAA__74xx-eu:74*245: Octal BUS TRANSCEIVER, 3-state
IC6 IC30 = 74xx-eu:74*154: 4-line to 16-line data SELECTOR/MULTIPLEXER
IC12 IC13 IC17 IC19 IC31 = AAA__74xx-eu:74*08: Quad 2-input AND gate
IC14 = AAA__74xx-eu:74*04: Hex INVERTER
IC15 IC16 IC18 = AAA__74xx-eu:74*00: Quad 2-input NAND gate
IC35 = 74xx-eu:74*138: 3-line to 8-line DECODER/DEMULTIPLEXER
IC38 IC39 = AAA__74xx-eu:74*30: 8-input NAND gate
IC40 = 74xx-little-de:74*1G00: 2-input NAND gate
IC41 = 74xx-little-de:74*1G08: 2-input AND gate
JP4 = pinhead:PINHD-1X11: PIN HEADER
LED1-LED4 LED8 = led:LED: LED
MB_C0 = pinhead:PINHD-2X16: PIN HEADER
PWR = pinhead:PINHD-2X4: PIN HEADER
PWR1 = pinhead_bottom:PINHD-2X4: PIN HEADER
R1-R10 = rcl:R-EU_: RESISTOR, European symbol; SPICEPREFIX: R
RAM_O_C0 RB1_C0 = pinhead_bottom:PINHD-2X19: PIN HEADER
RS2_C0 = pinhead:PINHD-2X7: PIN HEADER
SIGNALS_C0 = pinhead_bottom:PINHD-2X5: PIN HEADER
T1-T5 = transistor:*-NPN-: NPN Transistror BF959 corrected 2008.03.06
X1 = con-wago-500:W237-102: WAGO SCREW CLAMP; MPN: 237-102; OC_FARNELL: unknown; OC_NEWARK: 70K9898